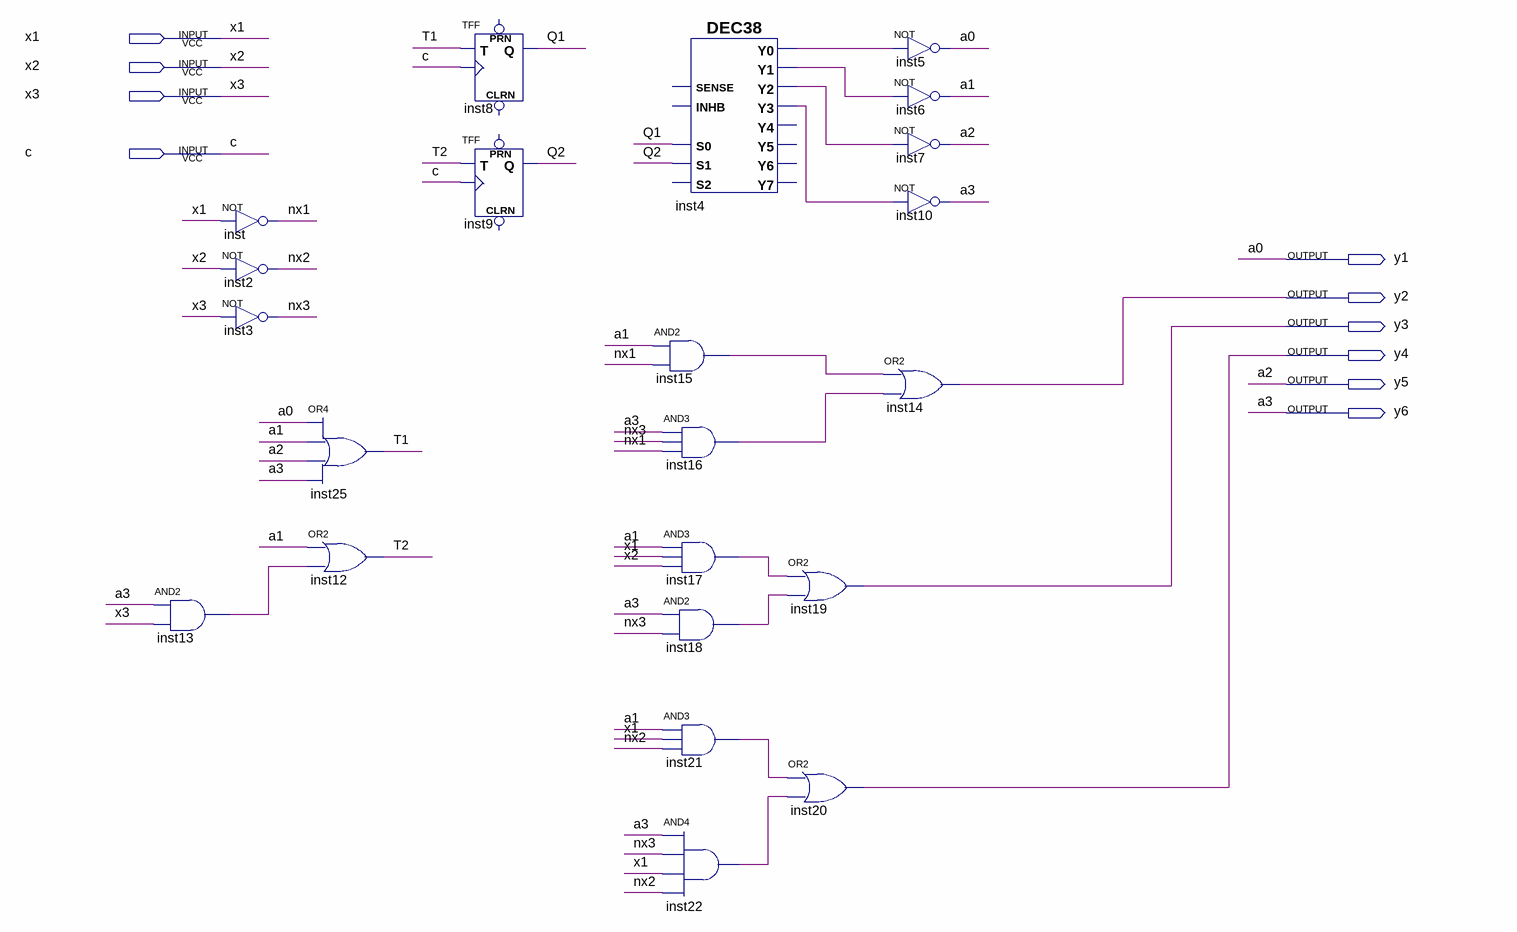
[diagram p0: schematic sheet]
// Quartus schematic lab.bdf as structural Verilog: 22 symbols, 10 pins
module lab (
  input  x1,
  input  x2,
  input  x3,
  input  c,
  output y1,
  output y2,
  output y3,
  output y4,
  output y5,
  output y6
);

  wire a1, inst4_y0, inst4_y1, inst4_y2, inst4_y3, inst13_out, inst15_out, inst16_out, inst17_out,
       inst18_out, inst21_out, inst22_out, nx1, nx2, nx3, Q1, Q2, T1, T2;

  not inst (nx1, x1);
  not inst2 (nx2, x2);
  not inst3 (nx3, x3);
  and inst13 (inst13_out, y6, x3);
  or inst25 (T1, y1, a1, y5, y6);
  or inst12 (T2, a1, inst13_out);
  TFF inst8 (.T(T1), .CLK(c), .Q(Q1));  // open: PRN, CLRN
  TFF inst9 (.T(T2), .CLK(c), .Q(Q2));  // open: PRN, CLRN
  DEC38 inst4 (
    .S1(Q2), .S0(Q1), .Y3(inst4_y3), .Y0(inst4_y0), .Y1(inst4_y1), .Y2(inst4_y2));  // open: S2, INHB, SENSE, Y7, Y6, Y5, Y4
  and inst15 (inst15_out, a1, nx1);
  and inst16 (inst16_out, y6, nx3, nx1);
  and inst17 (inst17_out, a1, x1, x2);
  and inst18 (inst18_out, y6, nx3);
  and inst21 (inst21_out, a1, x1, nx2);
  and inst22 (inst22_out, y6, nx3, x1, nx2);
  or inst19 (y3, inst17_out, inst18_out);
  or inst20 (y4, inst21_out, inst22_out);
  not inst5 (y1, inst4_y0);
  not inst6 (a1, inst4_y1);
  not inst7 (y5, inst4_y2);
  not inst10 (y6, inst4_y3);
  or inst14 (y2, inst15_out, inst16_out);

  // Other names for the same wires on the sheet: a0 = y1; a2 = y5; a3 = y6
endmodule
